# Altium schematic sheet TestingPCB.SchDoc
size A
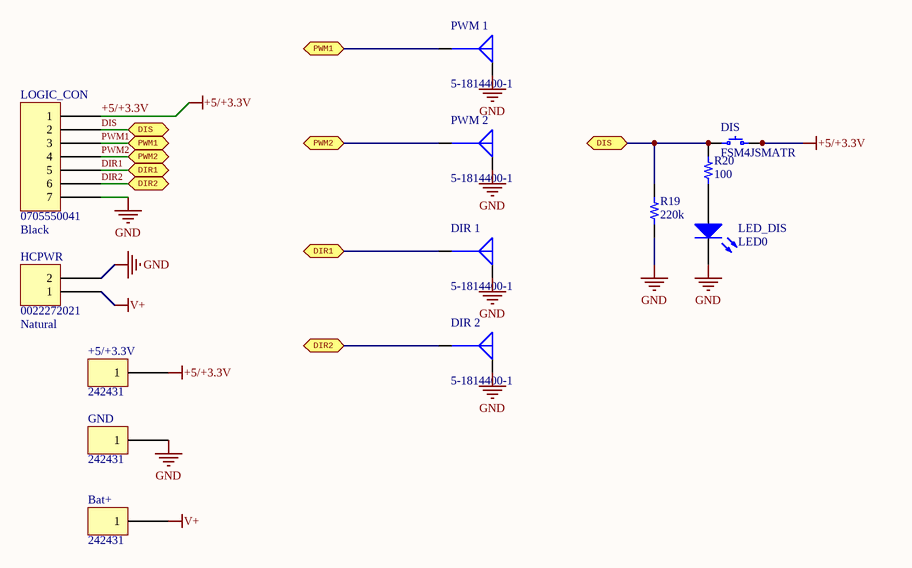
[diagram p0: TestingPCB.SchDoc]

## Parts
+5/+3.3V  242431  [242431 Banana]
Bat+  242431  [242431 Banana]
DIR_1  5-1814400-1  [MOLEX SD-73100-0114]
DIR_2  5-1814400-1  [MOLEX SD-73100-0114]
DIS  FSM4JSMATR  [TE FSM4JSMA]
GND  242431  [242431 Banana]
HCPWR  0022272021  Colour: Natural  [MOLEX KK 0022272021]
LED_DIS  LED0  [LED-0]
LOGIC_CON  0705550041  Colour: Black  [MOLEX SDA-70555-7PIN]
PWM_1  5-1814400-1  [MOLEX SD-73100-0114]
PWM_2  5-1814400-1  [MOLEX SD-73100-0114]
R19  220k  [RES 0603/1608]
R20  100  [RES 1206/3216]

## Ports
DIR1, DIR2, DIS, PWM1, PWM2

## Nets
+5/+3.3V: +5/+3.3V.1 DIS.3 DIS.4 LOGIC_CON.1
GND: DIR_1.G DIR_2.G GND.1 HCPWR.2 LED_DIS.2(K) LOGIC_CON.7 PWM_1.G PWM_2.G R19.1
V+: Bat+.1 HCPWR.1
DIR1: DIR_1.S LOGIC_CON.5 ; port DIR1
DIR2: DIR_2.S LOGIC_CON.6 ; port DIR2
DIS: DIS.1 DIS.2 LOGIC_CON.2 R19.2 R20.2 ; port DIS
PWM1: LOGIC_CON.3 PWM_1.S ; port PWM1
PWM2: LOGIC_CON.4 PWM_2.S ; port PWM2
NetLED_DIS_1: LED_DIS.1(A) R20.1

## Library data of the parts
+5/+3.3V Bat+ GND = 242431: Banana PCB Connector; Manufacturer: Multicomp; Voltage: 30V; Number Of Levels: 1; Part Number: 242431; PartId: 16448; Supplier 1: Farnell; Supplier Part Number 1: 1698983; ComponentLink1Description: Datasheet; ComponentLink1URL: http://www.farnell.com/datasheets/1901211.pdf?_ga=2.243946508.88394351.1508160428-490126870.1506116288&_gac=1.47786581.1506116288.CjwKCAjw6ZLOBRALEiwAxzyCWz0InfLjFu8mp1t2E94Bo3V2sP4VEUhaMoYFsFDilr1LVY; ComponentLink2Description: Farnell Listing; ComponentLink2URL: http://fr.farnell.com/multicomp/24-243-2/fiche-femelle-ci-4mm-noir/dp/1698983; Price: 1.83; Positions Per Level: 1
DIR_1 DIR_2 PWM_1 PWM_2 = 5-1814400-1: CONN SMA JACK R/A 50 OHM PCB; Manufacturer: TE Connectivity AMP Connectors; Contact Termination: Solder; Impedance: 50 Ohm; Frequency - Max: 3 GHz; Body Material: Zinc Alloy; Body Finish: Gold; Center Contact Material: Beryllium Copper; Dielectric Material: Polytetrafluoroethylene (PTFE); Part Number: 5-1814400-1; PartId: 16436; Supplier 1: Farnell; Supplier Part Number 1: 1248989; ComponentLink1Description: Datasheet; ComponentLink1URL: http://www.farnell.com/datasheets/1803168.pdf?_ga=2.243448460.88394351.1508160428-490126870.1506116288&_gac=1.223996649.1506116288.CjwKCAjw6ZLOBRALEiwAxzyCWz0InfLjFu8mp1t2E94Bo3V2sP4VEUhaMoYFsFDilr1LV; ComponentLink2Description: Farnell Listing; ComponentLink2URL: http://fr.farnell.com/te-connectivity-amp/5-1814400-1/embase-femelle-sma-angle-droit/dp/1248989?ost=5-1814400-1&iscrfnonsku=false&ddkey=http%3Afr-FR%2FElement14_France%2Fsearch; Price: 1.53; Type: Jack, Female Socket; Operating Temperature: -55°C ~ 85°C; Style: SMA; Shield Termination: Solder; Mounting Type: Through Hole, Right Angle; Fastening Type: Threaded; Housing Colour: Gold; Center Contact Plating: Gold
DIS = FSM4JSMATR: SWITCH TACTILE SPST-NO 0.05A 24V; Manufacturer: TE Connectivity Alcoswitch Switches; Switch Function: Off-Mom; Contact Rating @ Voltage: 0.05A @ 24VDC; Actuator Type: Standard; Actuator Orientation: Top Actuated; Illumination: Non-Illuminated; Operating Force: 160gf; Switch Travel: 0.25mm; Mechanical Life: 100,000 Cycles; Part Number: FSM4JSMATR; PartId: 8249; Supplier 1: Digi-Key; Supplier Part Number 1: 450-1759-2-ND; ComponentLink1Description: Datasheet; ComponentLink1URL: http://www.te.com/commerce/DocumentDelivery/DDEController?Action=srchrtrv&DocNm=2-1437565-7&DocType=Customer+Drawing&DocLang=English; ComponentLink2Description: Digi-Key Listing; ComponentLink2URL: http://www.digikey.com/product-detail/en/FSM4JSMATR/450-1759-2-ND/529675; Price: 0.128; Circuit: SPST-NO; Illumination Voltage: -; Illumination Type, Colour: -; Operating Temperature: -35C ~ 85C
HCPWR = 0022272021: CONN HEADER 2POS .100 VERT TIN; Manufacturer: Molex, LLC; Pitch: 0.100" (2.54mm); Number Of Positions: 2; Part Number: 0022272021; PartId: 9719; Supplier 1: Digi-Key; Supplier Part Number 1: WM4111-ND; ComponentLink1Description: Datasheet; ComponentLink1URL: http://www.molex.com/pdm_docs/sd/022272021_sd.pdf; ComponentLink2Description: Digi-Key Listing; ComponentLink2URL: http://www.digikey.com/product-search/en?keywords=22-27-2021; Price: 0.25; Type: Header, Unshrouded; Contact Finish: Tin; Fastening Type: Friction Lock; Number Of Rows: 1; Series: KK 6410
LED_DIS = LED0: Typical INFRARED GaAs LED; Published: 8-Jun-2000; LatestRevisionDate: 08-Jul-2005; LatestRevisionNote: Mech Layer 1 removed.; PackageReference: LED-0; Publisher: Altium Limited; PackageDescription: LED; 2 Leads
LOGIC_CON = 0705550041: CONN HEADER 7POS .100 R/A 15AU; Manufacturer: Molex, LLC; Pitch: 0.100" (2.54mm); Number Of Positions: 7; Part Number: 0705550041; PartId: 7813; Supplier 1: Digi-Key; Supplier Part Number 1: WM4180-ND; ComponentLink1Description: Datasheet; ComponentLink1URL: http://www.molex.com/pdm_docs/sd/705550001_sd.pdf; ComponentLink2Description: Digi-Key Listing; ComponentLink2URL: http://www.digikey.ca/product-detail/en/0705550041/WM4180-ND/1643414; Price: 3.99; Type: Through Hole, Right Angle; Contact Finish: Gold; Fastening Type: -; Number Of Rows: 1; Series: 70555
R19 = ERJ-PA3J224V: RES SMD 220K OHM 5% 1/4W 0603; Manufacturer: Panasonic Electronic Components; TemperatureRange: -55C ~ 155C; TemperatureCoefficient: 200ppm/C; PowerRating: 0.25W, 1/4W; Value: 220k; Part Number: ERJ-PA3J224V; PartId: 11334; Supplier 1: Digi-Key; Supplier Part Number 1: P220KBZTR-ND; ComponentLink1Description: Datasheet; ComponentLink1URL: //media.digikey.com/pdf/Data%20Sheets/Panasonic%20Electronic%20Components/ERJ_PA2_P03_PA3_P06_P08_P14.pdf; ComponentLink2Description: Digi-Key Listing; ComponentLink2URL: https://www.digikey.com/product-detail/en/panasonic-electronic-components/ERJ-PA3J224V/P220KBZTR-ND/5036020; Tolerance: 5%; Price: 0.0115; Device Package: 0603 (1608 Metric)
R20 = ERA-8AEB101V: RES SMD 100 OHM 0.1% 1/4W 1206; Manufacturer: Panasonic Electronic Components; TemperatureRange: -55C ~ 155C; TemperatureCoefficient: 25ppm/C; PowerRating: 0.25W, 1/4W; Value: 100; Part Number: ERA-8AEB101V; PartId: 3388; Supplier 1: Digi-Key; Supplier Part Number 1: P100BCTR-ND; ComponentLink1Description: Datasheet; ComponentLink1URL: http://industrial.panasonic.com/lecs/www-data/pdf/AOA0000/AOA0000CE26.pdf; ComponentLink2Description: Digi-Key listing; ComponentLink2URL: http://digikey.com/product-detail/en/ERA-8AEB101V/P100BCTR-ND/3070736; Tolerance: 0.1%; Price: 0.1954; Type: Thin Film; Device Package: 1206 (3216 Metric)